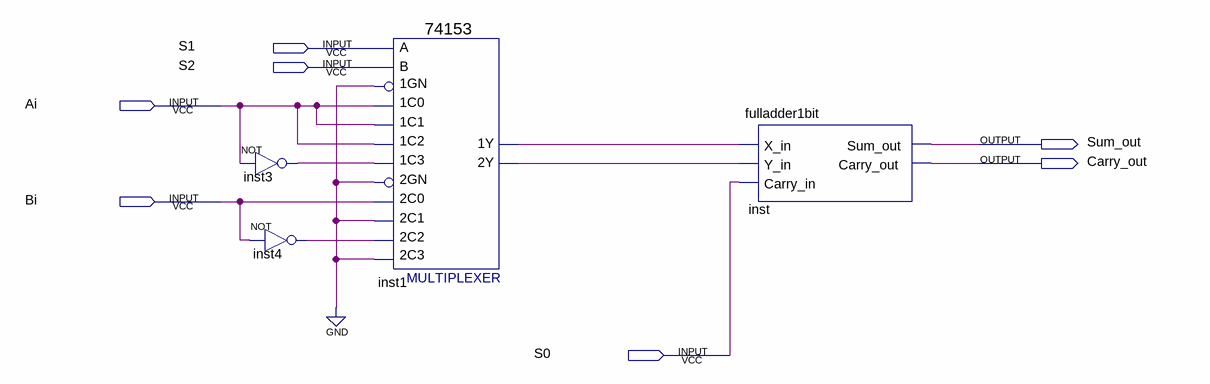
[diagram p0: schematic sheet]
// Quartus schematic arithcircuit1bit.bdf as structural Verilog: 4 symbols, 7 pins
module arithcircuit1bit (
  input  S1,
  input  S2,
  input  Ai,
  input  Bi,
  input  S0,
  output Sum_out,
  output Carry_out
);

  wire inst1_1y, inst1_2y, inst3_out, inst4_out;

  not inst3 (inst3_out, Ai);
  not inst4 (inst4_out, Bi);
  \74153  inst1 (
    .\1C1 (Ai), .\1GN (1'b0), .\1C0 (Ai), .\2C0 (Bi), .\2GN (1'b0), .\2C2 (inst4_out), .\1C2 (Ai),
    .\1C3 (inst3_out), .B(S2), .A(S1), .\2C1 (1'b0), .\2C3 (1'b0), .\1Y (inst1_1y), .\2Y (inst1_2y));
  fulladder1bit inst (.X_in(inst1_1y), .Y_in(inst1_2y), .Carry_in(S0), .Sum_out(Sum_out), .Carry_out(Carry_out));
endmodule
